# Altium schematic sheet 3.SchDoc
size OrCAD E
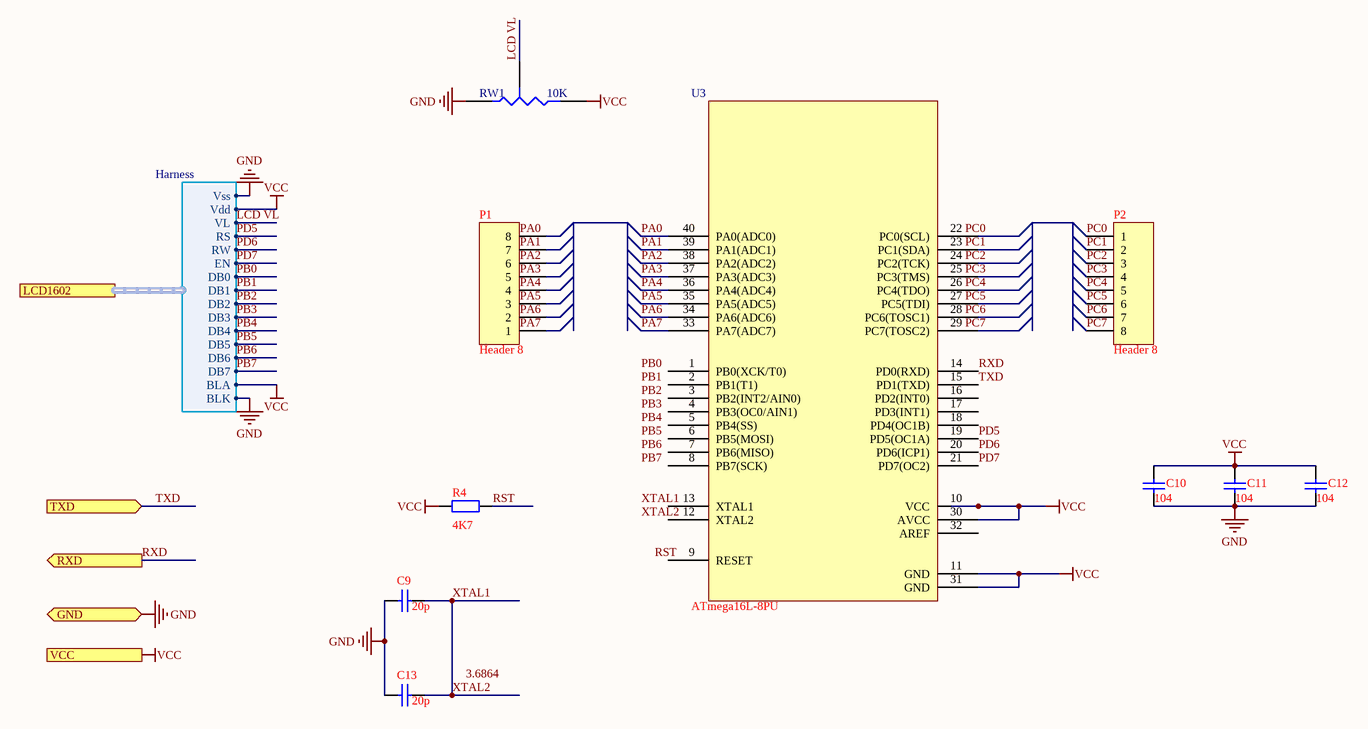
[diagram p0: 3.SchDoc]

## Parts
(Parts that share a designator on the sheet are numbered #1, #2 ... from top to bottom, then left to right.)
*#1  ATmega16L-8PU
*#2  ATmega16L-8PU
*#3  ATmega16L-8PU
*#4  ATmega16L-8PU
C9  value 20p  [0402]  (hidden comment: Cap Semi)
C10  value 104  [0402]  (hidden comment: Cap Semi)
C11  value 104  [0402]  (hidden comment: Cap Semi)
C12  value 104  [0402]  (hidden comment: Cap Semi)
C13  value 20p  [0402]  (hidden comment: Cap Semi)
P1  Header 8  [HDR1X8]
P2  Header 8  [HDR1X8]
R4  value 4K7  [AXIAL-0.4]  (hidden comment: Res2)
RW1  value 10K  [VR3]  (hidden comment: Res Tap)
U3  ATmega16L-8PU

## Ports
GND (bidir), LCD1602 (harness Harness), RXD (out), TXD (in), VCC (in)

## Harnesses
Harness: Vss, Vdd, VL, RS, RW, EN, DB0, DB1, DB2, DB3, DB4, DB5, DB6, DB7, BLA, BLK

## Nets
GND: C9.1 C10.2 C11.1 C12.1 C13.1 RW1.1(A) ; port GND, port LCD1602.Vss, port LCD1602.BLK
VCC: C10.1 C11.2 C12.2 R4.1 RW1.2(B) U3.10(VCC) U3.11(GND) U3.30(AVCC) U3.31(GND) ; port VCC, port LCD1602.Vdd, port LCD1602.BLA
LCD VL: RW1.3(TAP) ; port LCD1602.VL
PA0: U3.40(PA0(ADC0))
PA1: U3.39(PA1(ADC1))
PA2: U3.38(PA2(ADC2))
PA3: U3.37(PA3(ADC3))
PA4: U3.36(PA4(ADC4))
PA5: U3.35(PA5(ADC5))
PA6: U3.34(PA6(ADC6))
PA7: U3.33(PA7(ADC7))
PB0: port LCD1602.DB0
PB1: port LCD1602.DB1
PB2: port LCD1602.DB2
PB3: port LCD1602.DB3
PB4: port LCD1602.DB4
PB5: port LCD1602.DB5
PB6: port LCD1602.DB6
PB7: port LCD1602.DB7
PC0: P2.1
PC1: P2.2
PC2: P2.3
PC3: P2.4
PC4: P2.5
PC5: P2.6
PC6: P2.7
PC7: P2.8
PD5: U3.19(PD5(OC1A)) ; port LCD1602.RS
PD6: U3.20(PD6(ICP1)) ; port LCD1602.RW
PD7: U3.21(PD7(OC2)) ; port LCD1602.EN
RST: R4.2
RXD: U3.14(PD0(RXD)) ; port RXD
TXD: U3.15(PD1(TXD)) ; port TXD
XTAL1: C9.2 C13.2  [also labelled XTAL2]

Not connected (* = marked no-connect by the designer): *#1 1(PB0(XCK/T0)) 2(PB1(T1)) 3(PB2(INT2/AIN0)) 4(PB3(OC0/AIN1)) 5(PB4(SS)) 6(PB5(MOSI)) 7(PB6(MISO)) 8(PB7(SCK)) 9(RESET) 10(VCC) 11(GND) 12(XTAL2) 13(XTAL1) 14(PD0(RXD)) 15(PD1(TXD)) 16(PD2(INT0)) 17(PD3(INT1)) 18(PD4(OC1B)) 19(PD5(OC1A)) 20(PD6(ICP1)) 21(PD7(OC2)) 22(PC0(SCL)) 23(PC1(SDA)) 24(PC2(TCK)) 25(PC3(TMS)) 26(PC4(TDO)) 27(PC5(TDI)) 28(PC6(TOSC1)) 29(PC7(TOSC2)) 30(AVCC) 31(GND) 32(AREF) 33(PA7(ADC7)) 34(PA6(ADC6)) 35(PA5(ADC5)) 36(PA4(ADC4)) 37(PA3(ADC3)) 38(PA2(ADC2)) 39(PA1(ADC1)) 40(PA0(ADC0)); *#2 1(PB0(XCK/T0)) 2(PB1(T1)) 3(PB2(INT2/AIN0)) 4(PB3(OC0/AIN1)) 5(PB4(SS)) 6(PB5(MOSI)) 7(PB6(MISO)) 8(PB7(SCK)) 9(RESET) 10(VCC) 11(GND) 12(XTAL2) 13(XTAL1) 14(PD0(RXD)) 15(PD1(TXD)) 16(PD2(INT0)) 17(PD3(INT1)) 18(PD4(OC1B)) 19(PD5(OC1A)) 20(PD6(ICP1)) 21(PD7(OC2)) 22(PC0(SCL)) 23(PC1(SDA)) 24(PC2(TCK)) 25(PC3(TMS)) 26(PC4(TDO)) 27(PC5(TDI)) 28(PC6(TOSC1)) 29(PC7(TOSC2)) 30(AVCC) 31(GND) 32(AREF) 33(PA7(ADC7)) 34(PA6(ADC6)) 35(PA5(ADC5)) 36(PA4(ADC4)) 37(PA3(ADC3)) 38(PA2(ADC2)) 39(PA1(ADC1)) 40(PA0(ADC0)); *#3 1(PB0(XCK/T0)) 2(PB1(T1)) 3(PB2(INT2/AIN0)) 4(PB3(OC0/AIN1)) 5(PB4(SS)) 6(PB5(MOSI)) 7(PB6(MISO)) 8(PB7(SCK)) 9(RESET) 10(VCC) 11(GND) 12(XTAL2) 13(XTAL1) 14(PD0(RXD)) 15(PD1(TXD)) 16(PD2(INT0)) 17(PD3(INT1)) 18(PD4(OC1B)) 19(PD5(OC1A)) 20(PD6(ICP1)) 21(PD7(OC2)) 22(PC0(SCL)) 23(PC1(SDA)) 24(PC2(TCK)) 25(PC3(TMS)) 26(PC4(TDO)) 27(PC5(TDI)) 28(PC6(TOSC1)) 29(PC7(TOSC2)) 30(AVCC) 31(GND) 32(AREF) 33(PA7(ADC7)) 34(PA6(ADC6)) 35(PA5(ADC5)) 36(PA4(ADC4)) 37(PA3(ADC3)) 38(PA2(ADC2)) 39(PA1(ADC1)) 40(PA0(ADC0)); *#4 1(PB0(XCK/T0)) 2(PB1(T1)) 3(PB2(INT2/AIN0)) 4(PB3(OC0/AIN1)) 5(PB4(SS)) 6(PB5(MOSI)) 7(PB6(MISO)) 8(PB7(SCK)) 9(RESET) 10(VCC) 11(GND) 12(XTAL2) 13(XTAL1) 14(PD0(RXD)) 15(PD1(TXD)) 16(PD2(INT0)) 17(PD3(INT1)) 18(PD4(OC1B)) 19(PD5(OC1A)) 20(PD6(ICP1)) 21(PD7(OC2)) 22(PC0(SCL)) 23(PC1(SDA)) 24(PC2(TCK)) 25(PC3(TMS)) 26(PC4(TDO)) 27(PC5(TDI)) 28(PC6(TOSC1)) 29(PC7(TOSC2)) 30(AVCC) 31(GND) 32(AREF) 33(PA7(ADC7)) 34(PA6(ADC6)) 35(PA5(ADC5)) 36(PA4(ADC4)) 37(PA3(ADC3)) 38(PA2(ADC2)) 39(PA1(ADC1)) 40(PA0(ADC0)); P1 1 2 3 4 5 6 7 8; U3 1(PB0(XCK/T0)) 2(PB1(T1)) 3(PB2(INT2/AIN0)) 4(PB3(OC0/AIN1)) 5(PB4(SS)) 6(PB5(MOSI)) 7(PB6(MISO)) 8(PB7(SCK)) 9(RESET) 12(XTAL2) 13(XTAL1) 16(PD2(INT0)) 17(PD3(INT1)) 18(PD4(OC1B)) 22(PC0(SCL)) 23(PC1(SDA)) 24(PC2(TCK)) 25(PC3(TMS)) 26(PC4(TDO)) 27(PC5(TDI)) 28(PC6(TOSC1)) 29(PC7(TOSC2)) 32(AREF)

## Notes on the sheet
- Labels drawn without touching a wire or pin: 3.6864, PA0, PA1, PA2, PA3, PA4, PA5, PA6, PA7, PB0, PB1, PB2, PB3, PB4, PB5, PB6, PB7, PC0, PC1, PC2, PC3, PC4, PC5, PC6, PC7, RST, XTAL1, XTAL2

## Library data of the parts
C9-C13 = Cap Semi: Capacitor (Semiconductor SIM Model); Published: 8-Jun-2000; LatestRevisionDate: 29-May-2009; LatestRevisionNote: IPC-7351 Footprint Added.; PackageReference: C1206; Publisher: Altium Limited; PackageDescription: Chip Capacitor
P1 P2 = Header 8: Header, 8-Pin; LatestRevisionDate: 17-Jul-2002; LatestRevisionNote: Re-released for DXP Platform.; Publisher: Altium Limited
R4 = Res2: Resistor; Published: 8-Jun-2000; LatestRevisionDate: 17-Jul-2002; LatestRevisionNote: Re-released for DXP Platform.; PackageReference: AXIAL-0.4; Publisher: Altium Limited; PackageDescription: Axial Device, Thru-Hole; 2 Leads; 0.4 in Pin Spacing
RW1 = Res Tap: Tapped Resistor; Sim Note: Enter the Resistance value and the set point into parameter fields.; Set Position: 0.5; Published: 24-Mar-1999; LatestRevisionDate: 17-Jul-2002; LatestRevisionNote: Re-released for DXP Platform.; PackageReference: VR3; Publisher: Altium Limited; PackageDescription: Variable Resistor, Thru-Hole; 3 Leads